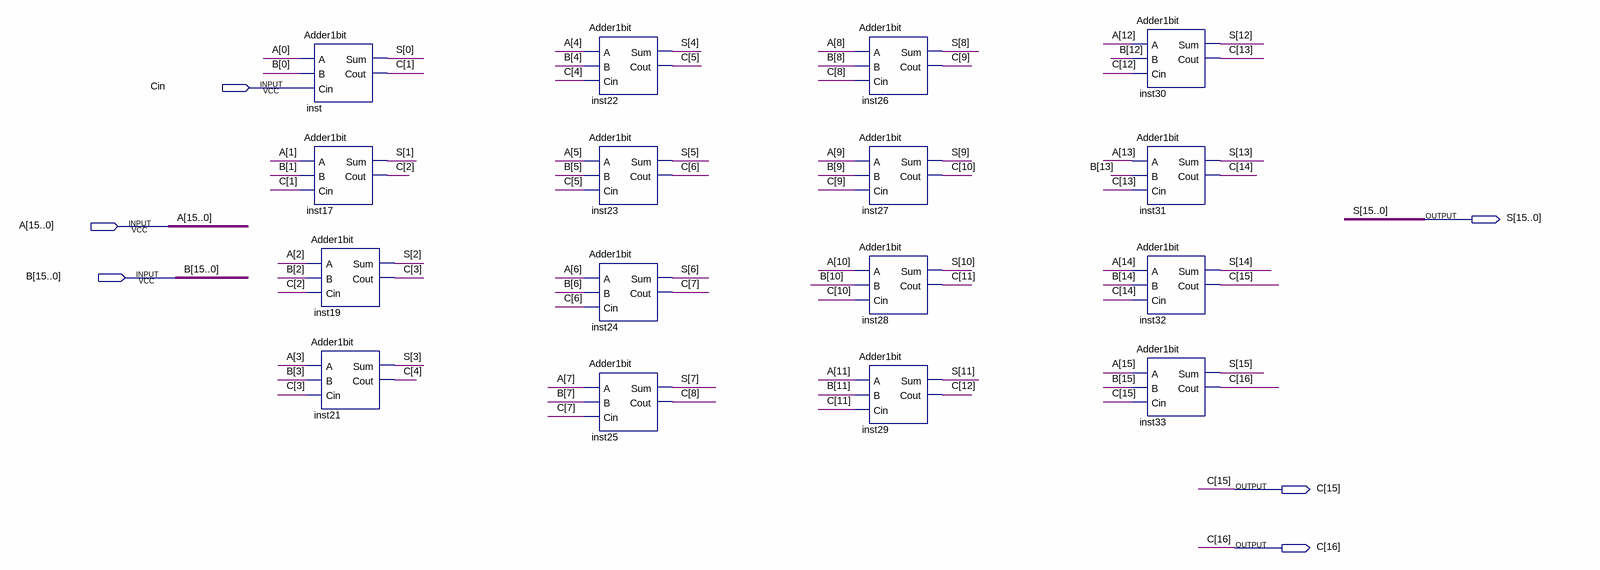
[diagram p0: schematic sheet]
// Quartus schematic FullAdder16bit.bdf as structural Verilog: 16 symbols, 6 pins
module FullAdder16bit (
  input  Cin,
  input  [15:0] A,
  input  [15:0] B,
  output [15:0] S,
  output [16:1] C
);

  Adder1bit inst (.A(A[0]), .B(B[0]), .Cin(Cin), .Sum(S[0]), .Cout(C[1]));
  Adder1bit inst17 (.A(A[1]), .B(B[1]), .Cin(C[1]), .Sum(S[1]), .Cout(C[2]));
  Adder1bit inst19 (.A(A[2]), .B(B[2]), .Cin(C[2]), .Sum(S[2]), .Cout(C[3]));
  Adder1bit inst21 (.A(A[3]), .B(B[3]), .Cin(C[3]), .Sum(S[3]), .Cout(C[4]));
  Adder1bit inst22 (.A(A[4]), .B(B[4]), .Cin(C[4]), .Sum(S[4]), .Cout(C[5]));
  Adder1bit inst23 (.A(A[5]), .B(B[5]), .Cin(C[5]), .Sum(S[5]), .Cout(C[6]));
  Adder1bit inst24 (.A(A[6]), .B(B[6]), .Cin(C[6]), .Sum(S[6]), .Cout(C[7]));
  Adder1bit inst25 (.A(A[7]), .B(B[7]), .Cin(C[7]), .Sum(S[7]), .Cout(C[8]));
  Adder1bit inst26 (.A(A[8]), .B(B[8]), .Cin(C[8]), .Sum(S[8]), .Cout(C[9]));
  Adder1bit inst27 (.A(A[9]), .B(B[9]), .Cin(C[9]), .Sum(S[9]), .Cout(C[10]));
  Adder1bit inst28 (.A(A[10]), .B(B[10]), .Cin(C[10]), .Sum(S[10]), .Cout(C[11]));
  Adder1bit inst29 (.A(A[11]), .B(B[11]), .Cin(C[11]), .Sum(S[11]), .Cout(C[12]));
  Adder1bit inst30 (.A(A[12]), .B(B[12]), .Cin(C[12]), .Sum(S[12]), .Cout(C[13]));
  Adder1bit inst31 (.A(A[13]), .B(B[13]), .Cin(C[13]), .Sum(S[13]), .Cout(C[14]));
  Adder1bit inst32 (.A(A[14]), .B(B[14]), .Cin(C[14]), .Sum(S[14]), .Cout(C[15]));
  Adder1bit inst33 (.A(A[15]), .B(B[15]), .Cin(C[15]), .Sum(S[15]), .Cout(C[16]));
endmodule
